# Altium project m13temp.PrjPCB
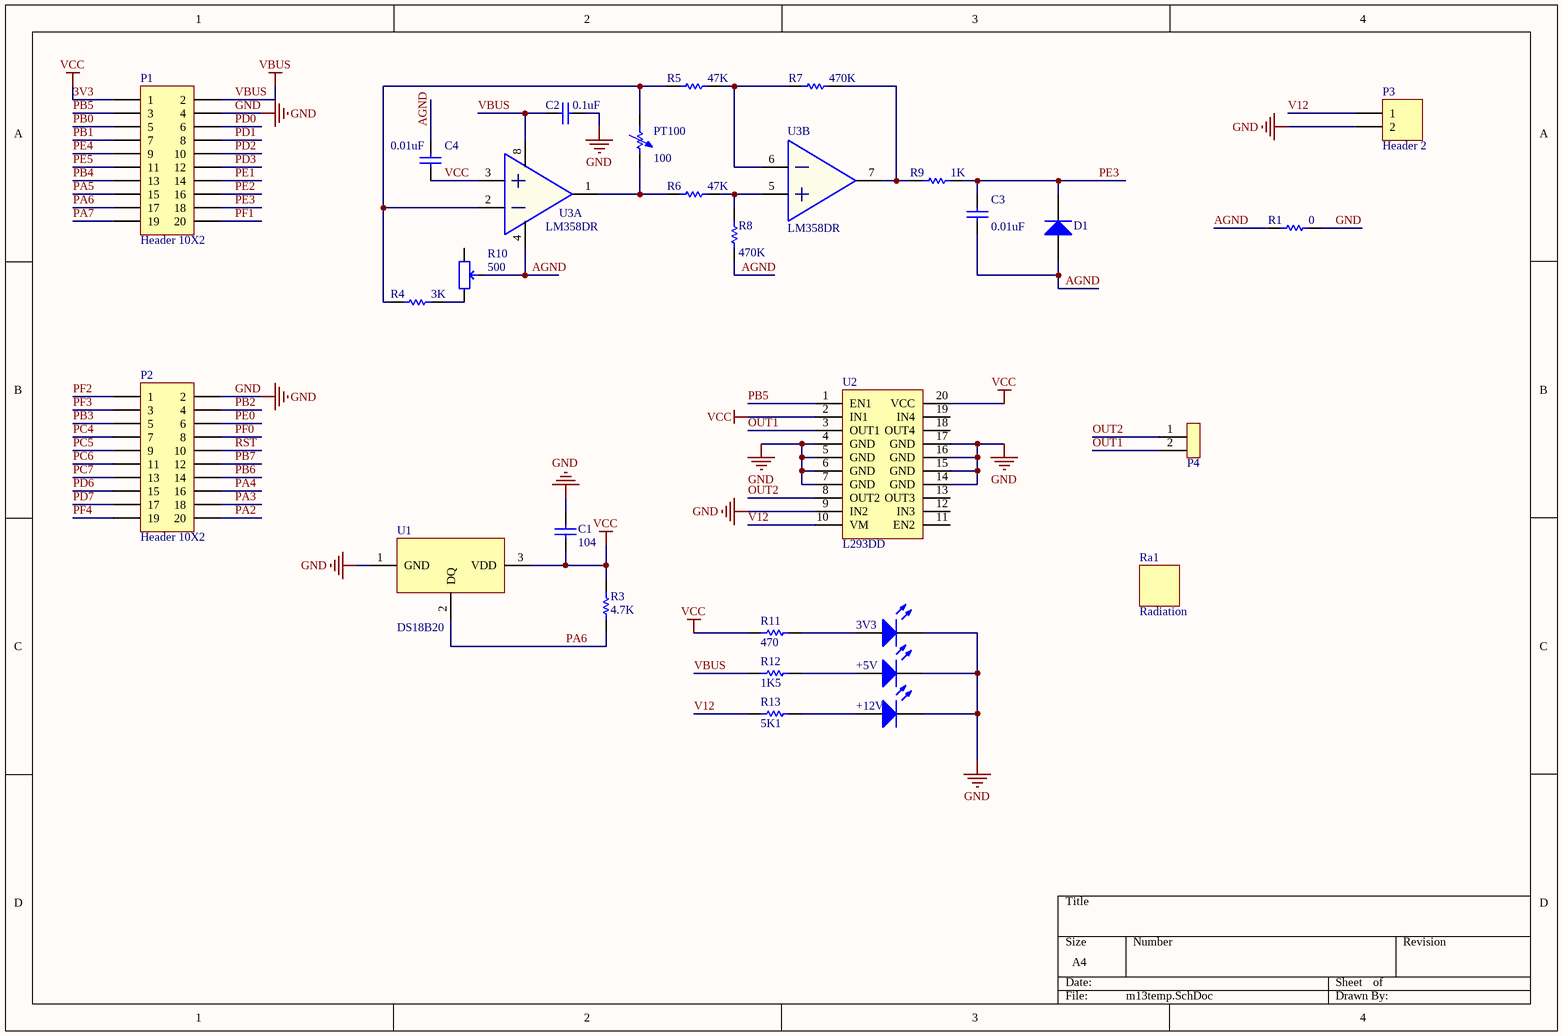
[diagram p0: m13temp.SchDoc]
1 sheet, 29 parts. Net scope: global (net labels, ports and power ports of the same name join across sheets).
Board file: m13temp.PcbDoc

## Sheet m13temp.SchDoc
size A4

### Parts
3V3  LED2  [LED_0603_RED]  (value not drawn)
+5V  LED2  [LED_0603_RED]  (value not drawn)
+12V  LED2  [LED_0603_RED]  (value not drawn)
C1  value 104  [CAP_0603]  (hidden comment: Cap Semi)
C2  value 0.1uF  [CAP_0603]  (hidden comment: Cap Semi)
C3  value 0.01uF  [CAP_0603]  (hidden comment: Cap Semi)
C4  value 0.01uF  [CAP_0603]  (hidden comment: Cap Semi)
D1  1N4728  [DIAO]  (value not drawn)
P1  Header 10X2  [HDR2X10]
P2  Header 10X2  [HDR2X10]
P3  Header 2  [MKDSN_2RMI]
P4  Header2  [XPH2]  (value not drawn)
PT100  value 100  [PT100]  (hidden comment: PT100)
R1  value 0  [RES_0603]  (hidden comment: Res Semi)
R3  value 4.7K  [RES_0603]  (hidden comment: Res Semi)
R4  value 3K  [RES_0603]  (hidden comment: Res Semi)
R5  value 47K  [RES_0603]  (hidden comment: Res Semi)
R6  value 47K  [RES_0603]  (hidden comment: Res Semi)
R7  value 470K  [RES_0603]  (hidden comment: Res Semi)
R8  value 470K  [RES_0603]  (hidden comment: Res Semi)
R9  value 1K  [RES_0603]  (hidden comment: Res Semi)
R10  value 500  [RES_TRIMMER]  (hidden comment: Res_Trimmer)
R11  value 470  [RES_0603]  (hidden comment: Res Semi)
R12  value 1K5  [RES_0603]  (hidden comment: Res Semi)
R13  value 5K1  [RES_0603]  (hidden comment: Res Semi)
Ra1  Radiation  [Radiation]
U1  DS18B20  [TO-92]
U2  L293DD  [SOP20]
U3  LM358DR  [SOIC_8]  (parts A,B of 2)

### Nets
3V3: C1.2 C4.1 P1.1 R3.1 R11.1 U1.3(VDD) U2.2(IN1) U2.20(VCC) U3.3(1IN+)  [also labelled VCC]
GND: 3V3.2(K) +5V.2(K) +12V.2(K) C1.1 C2.2 P1.4 P2.2 P3.2 R1.1 U1.1(GND) U2.4(GND) U2.5(GND) U2.6(GND) U2.7(GND) U2.9(IN2) U2.14(GND) U2.15(GND) U2.16(GND) U2.17(GND)
VBUS: C2.1 P1.2 R12.1 U3.8(VCC)
AGND: C3.1 C4.2 D1.1(A) R1.2 R8.1 R10.2(W) U3.4(GND)
OUT1: P4.2 U2.3(OUT1)
OUT2: P4.1 U2.8(OUT2)
PA2: P2.20
PA3: P2.18
PA4: P2.16
PA5: P1.15
PA6: P1.17 R3.2 U1.2(DQ)
PA7: P1.19
PB0: P1.5
PB1: P1.7
PB2: P2.4
PB3: P2.5
PB4: P1.13
PB5: P1.3 U2.1(EN1)
PB6: P2.14
PB7: P2.12
PC4: P2.7
PC5: P2.9
PC6: P2.11
PC7: P2.13
PD0: P1.6
PD1: P1.8
PD2: P1.10
PD3: P1.12
PD6: P2.15
PD7: P2.17
PE0: P2.6
PE1: P1.14
PE2: P1.16
PE3: C3.2 D1.2(K) P1.18 R9.1
PE4: P1.9
PE5: P1.11
PF0: P2.8
PF1: P1.20
PF2: P2.1
PF3: P2.3
PF4: P2.19
RST: P2.10
V12: P3.1 R13.1 U2.10(VM)
Net3V3_1: 3V3.1(A) R11.2
Net+5V_1: +5V.1(A) R12.2
Net+12V_1: +12V.1(A) R13.2
NetPT100_1: PT100.1 R4.1 R5.1 U3.2(1IN-)
NetPT100_2: PT100.2 R6.1 U3.1(1OUT)
NetR4_2: R4.2 R10.1(CCW)
NetR5_2: R5.2 R7.1 U3.6(2IN-)
NetR6_2: R6.2 R8.2 U3.5(2IN+)
NetR7_2: R7.2 R9.2 U3.7(2OUT)

Not connected (* = marked no-connect by the designer): R10 3(CW); U2 11(EN2) 12(IN3) 13(OUT3) 18(OUT4) 19(IN4)

### Library data of the parts
3V3 +5V +12V = LED2: Typical RED, GREEN, YELLOW, AMBER GaAs LED; Published: 8-Jun-2000; LatestRevisionDate: 17-Jul-2002; LatestRevisionNote: Re-released for DXP Platform.; PackageVersion: Feb-2002; PackageReference: 3.2X1.6X1.1; Publisher: Altium Limited
C1-C4 = Cap Semi: Capacitor (Semiconductor SIM Model); Published: 8-Jun-2000; LatestRevisionDate: 29-May-2009; LatestRevisionNote: IPC-7351 Footprint Added.; PackageReference: C1206; Publisher: Altium Limited; PackageDescription: Chip Capacitor
D1 = Diode 1N4148: High Conductance Fast Diode; Published: 8-Jun-2000; LatestRevisionDate: 17-Jul-2002; LatestRevisionNote: Re-released for DXP Platform.; DatasheetVersion: 1997; PackageReference: DO-35; Publisher: Altium Limited; Code_JEDEC: DO-204-AH; ComponentLink1Description: Manufacturer Link; ComponentLink1URL: http://www.fairchildsemi.com/; ComponentLink2Description: Datasheet; ComponentLink2URL: http://www.fairchildsemi.com/ds/1N%2F1N4148.pdf
P1 P2 = Header 10X2: Header, 10-Pin, Dual row; LatestRevisionDate: 17-Jul-2002; LatestRevisionNote: Re-released for DXP Platform.; Publisher: Altium Limited
P3 = Header 2: Header, 2-Pin; LatestRevisionDate: 17-Jul-2002; LatestRevisionNote: Re-released for DXP Platform.; Publisher: Altium Limited
PT100 = Res Adj1: Variable Resistor; Set Position: 0.5; Published: 8-Jun-2000; LatestRevisionDate: 17-Jul-2002; LatestRevisionNote: Re-released for DXP Platform.; PackageReference: AXIAL-0.7; Publisher: Altium Limited
R1 R3-R9 R11-R13 = Res Semi: Semiconductor Resistor; Published: 8-Jun-2000; LatestRevisionDate: 17-Jul-2002; LatestRevisionNote: Re-released for DXP Platform.; PackageReference: AXIAL-0.5; Publisher: Altium Limited
R10 = Res_Trimmer: Resistor
U1 = DS18B20: Programmable Resolution  1-Wire Digital Thermometer
U2 = L293DD: L293DD MOTOR
U3 = LM358DR: Dual Operational Amplifiers